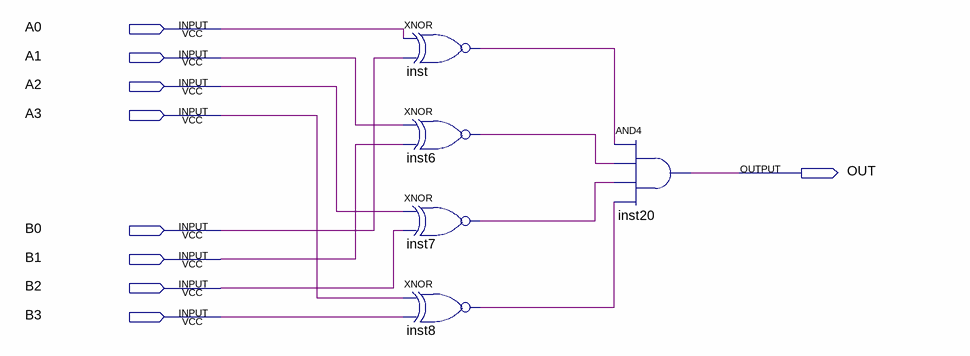
[diagram p0: schematic sheet]
// Quartus schematic Comparador.bdf as structural Verilog: 5 symbols, 9 pins
module Comparador (
  input  A0,
  input  A1,
  input  A2,
  input  A3,
  input  B0,
  input  B1,
  input  B2,
  input  B3,
  output OUT
);

  wire inst6_out, inst7_out, inst8_out, inst_out;

  xnor inst (inst_out, A0, B0);
  xnor inst6 (inst6_out, A1, B1);
  xnor inst7 (inst7_out, A2, B2);
  xnor inst8 (inst8_out, A3, B3);
  and inst20 (OUT, inst_out, inst6_out, inst7_out, inst8_out);
endmodule
